# Altium schematic sheet ESP32_DevKit.SchDoc
size A3
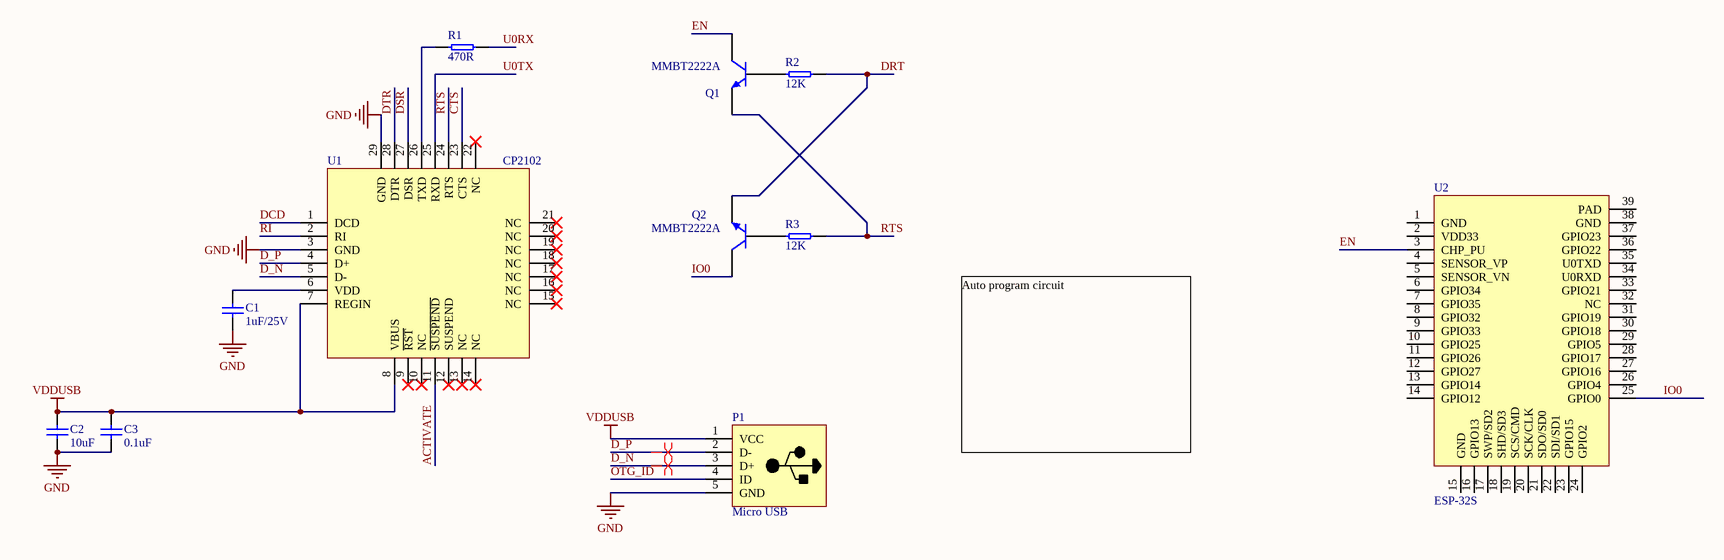
[diagram p0: ESP32_DevKit.SchDoc]

## Parts
C1  1uF/25V  [C0805]
C2  10uF  [C0805]
C3  0.1uF  [C0603]
P1  Micro USB
Q1  MMBT2222A  [SOT_23]
Q2  MMBT2222A  [SOT_23]
R1  470R  [R0805]
R2  12K  [R0805]
R3  12K  [R0805]
U1  CP2102
U2  ESP-32S

## Nets
 GND: C1.1 C2.1 C3.1 P1.5(GND) U1.3(GND) U1.29(GND)  [also labelled GND]
VDDUSB: C2.2 C3.2 P1.1(VCC) U1.7(REGIN) U1.8(VBUS)
ACTIVATE: U1.11(~{SUSPEND})
CTS: U1.23(CTS)
D_N: P1.3(D+) U1.5(D-)
D_P: P1.2(D-) U1.4(D+)
DCD: U1.1(DCD)
DRT: Q2.3(E) R2.2
DSR: U1.27(DSR)
DTR: U1.28(DTR)
EN: Q1.2(C) U2.3(CHP_PU)
IO0: Q2.2(C) U2.25(GPIO0)
OTG_ID: P1.4(ID)
RI: U1.2(RI)
RTS: Q1.3(E) R3.2 U1.24(RTS)
U0RX: R1.1
U0TX: U1.25(RXD)
NetC1_2: C1.2 U1.6(VDD)
NetQ1_1: Q1.1(B) R2.1
NetQ2_1: Q2.1(B) R3.1
NetR1_2: R1.2 U1.26(TXD)

Not connected (* = marked no-connect by the designer): U1 9(~{RST})* 10(NC)* 12(SUSPEND)* 13(NC)* 14(NC)* 15(NC)* 16(NC)* 17(NC)* 18(NC)* 19(NC)* 20(NC)* 21(NC)* 22(NC)*; U2 1(GND) 2(VDD33) 4(SENSOR_VP) 5(SENSOR_VN) 6(GPIO34) 7(GPIO35) 8(GPIO32) 9(GPIO33) 10(GPIO25) 11(GPIO26) 12(GPIO27) 13(GPIO14) 14(GPIO12) 15(GND) 16(GPIO13) 17(SWP/SD2) 18(SHD/SD3) 19(SCS/CMD) 20(SCK/CLK) 21(SDO/SD0) 22(SDI/SD1) 23(GPIO15) 24(GPIO2) 26(GPIO4) 27(GPIO16) 28(GPIO17) 29(GPIO5) 30(GPIO18) 31(GPIO19) 32(NC) 33(GPIO21) 34(U0RXD) 35(U0TXD) 36(GPIO22) 37(GPIO23) 38(GND) 39(PAD)

## Layout directives
differential pair: D_N, D_P

## Notes on the sheet
- Auto program circuit

## Library data of the parts
C1 = C1uF_0805: CAP CER 1UF 25V X7R 0805; Manufacturer: TDK; Manufacturer Part Number: CGA4J3X7R1E105K125AB; Tolerance: 10%; Supplier 1: Digi-Key; Supplier Part Number 1: 445-5687-1-ND; Stock 1: 188848; Pricing 1: 1 = 0.24000, 10 = 0.16300, 100 = 0.08260, 500 = 0.05652, 1000 = 0.04999 (USD); RoHS: Yes; Mount: Surface Mount; Case/Package: 0805; Weight: 0.000194oz; Case Code (Metric): 2012; Case Code (Imperial): 0805; Min Operating Temperature: -55°C; Max Operating Temperature: 125°C; Packaging: Tape and Reel; Capacitance: 1uF; Voltage Rating: 25V; Termination: SMD/SMT; Voltage Rating (DC): 25V; Package Quantity: 1; Dielectric: X7R; Composition: Ceramic; Length: 2mm; Height: 1.25mm; Width: 0.049inch; Thickness: 0.057inch; Depth: 1.25mm; Ratings: AEC-Q200; REACH SVHC: No SVHC; ComponentLink1URL: https://datasheet.ciiva.com/24216/cga4j3x7r1e105k125ab-266263-24216931.pdf?src-supplier=Mouser; ComponentLink1Description: https://datasheet.ciiva.com/24216/cga4j3x7r1e105k125ab-266263-24216931.pdf?src-supplier=Mouser
C2 = C10uF_0805: CAP CER 10UF 6.3V X5R 0805; Manufacturer: Samsung; Manufacturer Part Number: CL21A106KQCLRNC; Tolerance: 10%; Supplier 1: Digi-Key; Stock 1: 223622; Pricing 1: 1 = 0.12000, 10 = 0.08500, 100 = 0.03810, 500 = 0.02718, 1000 = 0.02136 (USD); RoHS: Yes; Mount: Surface Mount; Case/Package: 0805; Case Code (Metric): 2012; Case Code (Imperial): 0805; Min Operating Temperature: -55°C; Max Operating Temperature: 85°C; Package Quantity: 1; Packaging: Tape and Reel; Capacitance: 10uF; Voltage Rating: 6.3V; Length: 0.079inch; Width: 0.049inch; Thickness: 0.037inch; ComponentLink1URL: https://datasheet.ciiva.com/25772/cl21a106kqclrnc-25772948.pdf?src-supplier=Digi-Key; ComponentLink1Description: https://datasheet.ciiva.com/25772/cl21a106kqclrnc-25772948.pdf?src-supplier=Digi-Key; Supplier Part Number 1: 1276-2405-1-ND
C3 = C0.1uF_0603
P1 = Micro_USB
Q1 Q2 = MMBT2222A: Transistors Bipolar - BJT SOT-23 NPN GEN PUR; Manufacture: Fairchild Semiconductor; BSH Part number: Q-MMBT2222A; Datasheet: http://www.mouser.com/ds/2/149/MMBT2222A-69200.pdf; Part number: MMBT2222A; Mouser add: http://vn.mouser.com/ProductDetail/Fairchild-Semiconductor/MMBT2222A/?qs=sGAEpiMZZMutXGli8Ay4kHKRdIvtrnJvbVzYv9px7so%3d
R1 = R470R_0805
R2 R3 = R12K_0805: RES SMD 12K OHM 5% 1/8W 0805; Manufacturer: Yageo; Manufacturer Part Number: RC0805JR-0712KL; Resistance: 12kR; Temperature Coefficient: 100ppm/°C; Power Rating: 125mW; Voltage Rating: 150V; Supplier 1: Digi-Key; Supplier Part Number 1: 311-12KARCT-ND; Stock 1: 440700; Pricing 1: 1 = 0.10000, 10 = 0.03500, 100 = 0.01400, 1000 = 0.00631, 2500 = 0.00548 (USD); RoHS: Yes; Case/Package: 0805; Contact Plating: Tin,Matte,Lead; Case Code (Imperial): 0805; Case Code (Metric): 2012; Min Operating Temperature: -55°C; Max Operating Temperature: 155°C; Tolerance: 5%; Composition: Thick Film; Packaging: Tape and Reel; Package Quantity: 5000; Termination: SMD/SMT; Military Standard: Not; Length: 2mm; Height: 0.5mm; Width: 1.25mm; Depth: 1.25mm; Radiation Hardening: No; REACH SVHC: Unknown; Lead Free: Lead Free; ComponentLink1URL: https://datasheet.ciiva.com/7941/442941-7941880.pdf?src-supplier=Element14; ComponentLink1Description: https://datasheet.ciiva.com/7941/442941-7941880.pdf?src-supplier=Element14; ComponentLink2URL: https://datasheet.ciiva.com/7941/442941-7941881.pdf?src-supplier=Element14; ComponentLink2Description: https://datasheet.ciiva.com/7941/442941-7941881.pdf?src-supplier=Element14; ComponentLink3URL: https://datasheet.ciiva.com/17082/rc0805-17082649.pdf?src-supplier=Future+Electronics; ComponentLink3Description: https://datasheet.ciiva.com/17082/rc0805-17082649.pdf?src-supplier=Future+Electronics